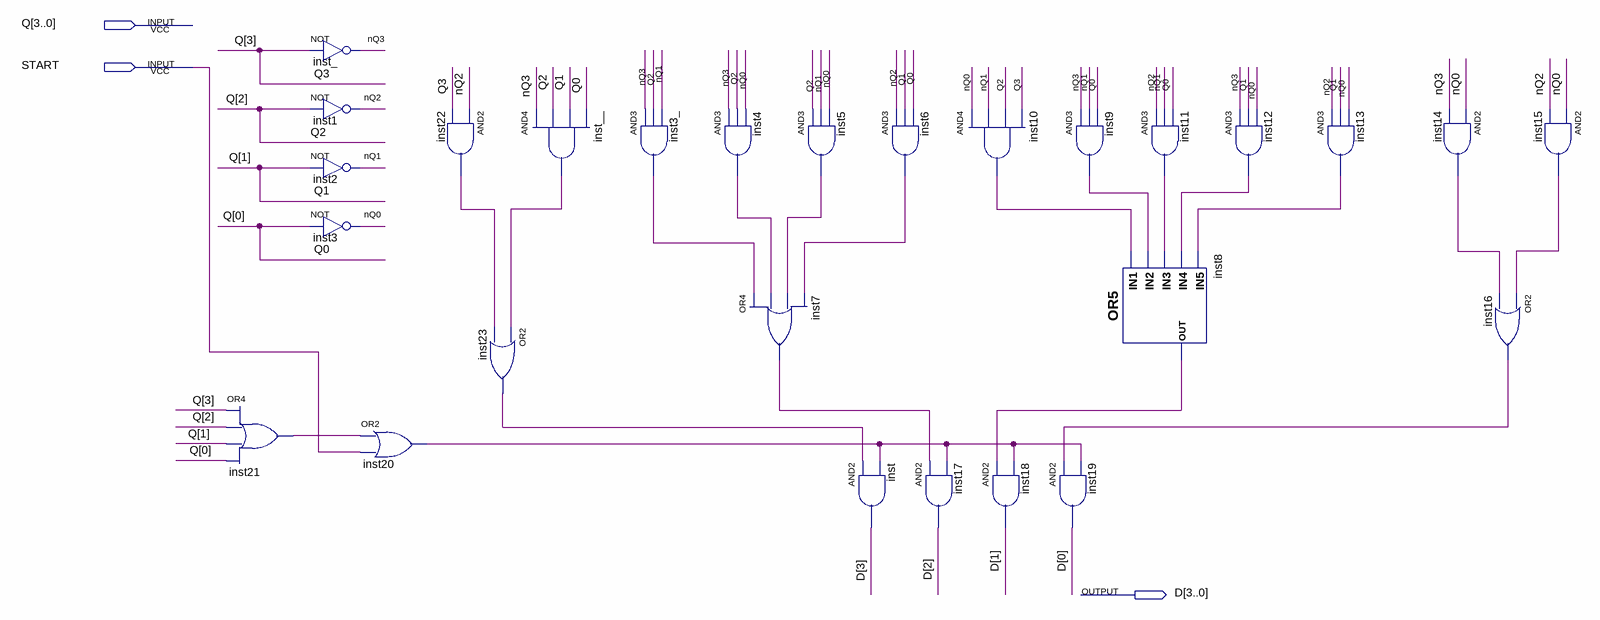
[diagram p0: schematic sheet]
// Quartus schematic NEXT_STA.bdf as structural Verilog: 27 symbols, 3 pins
module NEXT_STA (
  input  [3:0] Q,
  input  START,
  output [3:0] D
);

  wire inst3__out, inst4_out, inst5_out, inst6_out, inst7_out, inst8_out, inst9_out, inst10_out, inst11_out,
       inst12_out, inst13_out, inst14_out, inst15_out, inst16_out, inst20_out, inst21_out, inst22_out,
       inst23_out, inst___out, nQ0, nQ1, nQ2, nQ3;

  or inst21 (inst21_out, Q[3], Q[2], Q[1], Q[0]);
  not inst_ (nQ3, Q[3]);
  not inst1 (nQ2, Q[2]);
  not inst2 (nQ1, Q[1]);
  not inst3 (nQ0, Q[0]);
  or inst20 (inst20_out, inst21_out, START);
  and inst22 (inst22_out, nQ2, Q[3]);
  or inst23 (inst23_out, inst___out, inst22_out);
  and inst__ (inst___out, nQ3, Q[2], Q[1], Q[0]);
  and inst3_ (inst3__out, nQ3, Q[2], nQ1);
  and inst4 (inst4_out, nQ3, Q[2], nQ0);
  or inst7 (inst7_out, inst3__out, inst4_out, inst5_out, inst6_out);
  and inst5 (inst5_out, Q[2], nQ1, nQ0);
  and inst6 (inst6_out, nQ2, Q[1], Q[0]);
  and inst (D[3], inst23_out, inst20_out);
  and inst10 (inst10_out, nQ0, nQ1, Q[2], Q[3]);
  and inst17 (D[2], inst7_out, inst20_out);
  and inst18 (D[1], inst8_out, inst20_out);
  and inst9 (inst9_out, nQ3, nQ1, Q[0]);
  and inst19 (D[0], inst16_out, inst20_out);
  and inst11 (inst11_out, nQ2, nQ1, Q[0]);
  or inst8 (inst8_out, inst10_out, inst9_out, inst11_out, inst12_out, inst13_out);
  and inst12 (inst12_out, nQ3, Q[1], nQ0);
  and inst13 (inst13_out, nQ2, Q[1], nQ0);
  and inst14 (inst14_out, nQ0, nQ3);
  or inst16 (inst16_out, inst15_out, inst14_out);
  and inst15 (inst15_out, nQ0, nQ2);
endmodule
